# Altium schematic sheet MCU1807301205.SchDoc
size A3
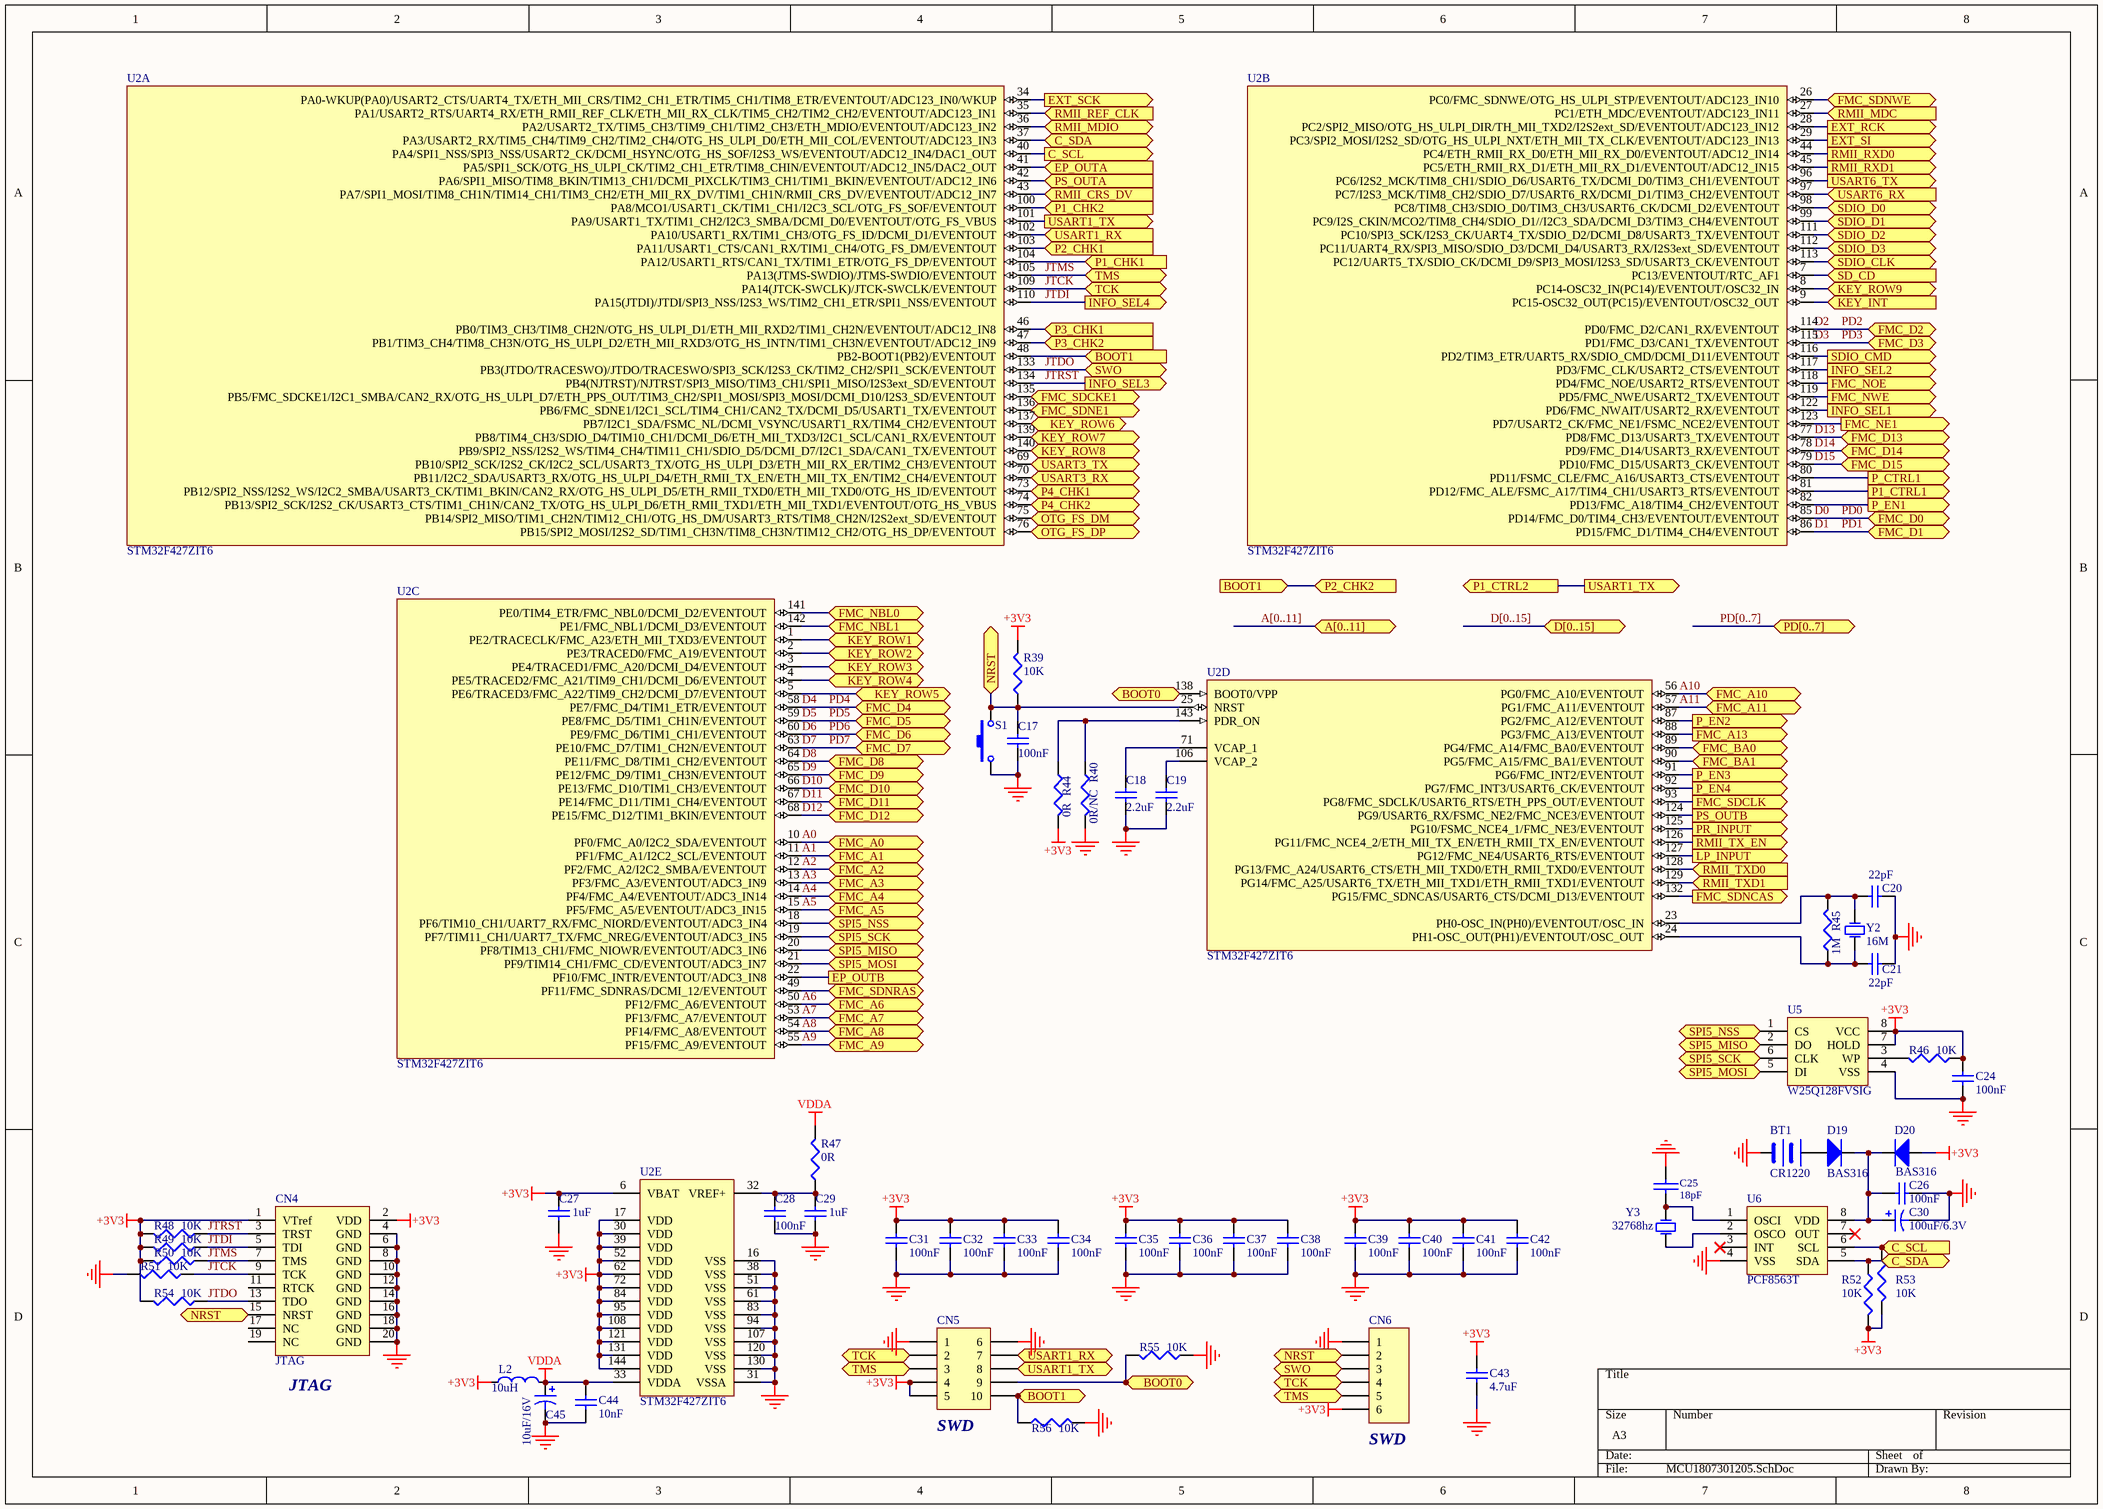
[diagram p0: MCU1807301205.SchDoc]

## Parts
BT1  CR1220  [CR1220]
C17  100nF  [C0603]
C18  2.2uF  [C0603]
C19  2.2uF  [C0603]
C20  22pF  [C0603]
C21  22pF  [C0603]
C24  100nF  [C0603]
C25  18pF  [C0603]
C26  100nF  [C0603]
C27  1uF  [C0603]
C28  100nF  [C0603]
C29  1uF  [C0603]
C30  100uF/6.3V  [CE1210]
C31  100nF  [C0603]
C32  100nF  [C0603]
C33  100nF  [C0603]
C34  100nF  [C0603]
C35  100nF  [C0603]
C36  100nF  [C0603]
C37  100nF  [C0603]
C38  100nF  [C0603]
C39  100nF  [C0603]
C40  100nF  [C0603]
C41  100nF  [C0603]
C42  100nF  [C0603]
C43  4.7uF  [C0805]
C44  10nF  [C0603]
C45  10uF/16V  [CE1210]
CN4  JTAG  [DC3-2x10P]
CN5  (no value)  [HDR2X5_CEN]
CN6  (no value)  [HDR1X6]
D19  BAS316  [D0805]
D20  BAS316  [D0805]
L2  10uH  [b0805]
R39  10K  [R0603]
R40  0R/NC  [R0603]
R44  0R  [R0603]
R45  1M  [R0603]
R46  10K  [R0603]
R47  0R  [R0603]
R48  10K  [R0603]
R49  10K  [R0603]
R50  10K  [R0603]
R51  10K  [R0603]
R52  10K  [R0603]
R53  10K  [R0603]
R54  10K  [R0603]
R55  10K  [R0603]
R56  10K  [R0603]
S1  (no value)  [SW_1102S]
U2  STM32F427ZIT6  [LQFP144_M]  (parts A,B,C,D,E of 5)
U5  W25Q128FVSIG  [SOIC8W]
U6  PCF8563T  [SOIC8]
Y2  16M  [OSC3225]
Y3  32768hz  [FC-135]

## Ports
A[0..11] (bidir), BOOT0, BOOT1, BOOT1 (in), C_SCL (in), C_SCL (out), C_SDA, C_SDA (bidir), D[0..15] (bidir), EP_OUTA (in), EP_OUTB (out), EXT_RCK (out), EXT_SCK (out), EXT_SI (out), FMC_A0, FMC_A1, FMC_A2, FMC_A3, FMC_A4, FMC_A5, FMC_A6, FMC_A7, FMC_A8, FMC_A9, FMC_A10, FMC_A11, FMC_A13 (out), FMC_BA0, FMC_BA1, FMC_D0, FMC_D1, FMC_D2, FMC_D3, FMC_D4, FMC_D5, FMC_D6, FMC_D7, FMC_D8, FMC_D9, FMC_D10, FMC_D11, FMC_D12, FMC_D13, FMC_D14, FMC_D15, FMC_NBL0, FMC_NBL1, FMC_NE1 (out), FMC_NOE (out), FMC_NWE (out), FMC_SDCKE1, FMC_SDCLK (out), FMC_SDNCAS (out), FMC_SDNE1, FMC_SDNRAS, FMC_SDNWE, INFO_SEL1 (out), INFO_SEL2 (out), INFO_SEL3 (out), INFO_SEL4 (out), KEY_INT (in), KEY_ROW1 (bidir), KEY_ROW2 (bidir), KEY_ROW3 (bidir), KEY_ROW4 (bidir), KEY_ROW5 (bidir), KEY_ROW6 (bidir), KEY_ROW7 (bidir), KEY_ROW8 (bidir), KEY_ROW9 (bidir), LP_INPUT (out), NRST, OTG_FS_DM, OTG_FS_DP, P1_CHK1 (in), P1_CHK2 (in), P1_CTRL1 (out), P1_CTRL2 (out), P2_CHK1 (in), P2_CHK2 (in), P3_CHK1 (in), P3_CHK2 (in), P4_CHK1 (in), P4_CHK2 (in), P_CTRL1 (out), P_EN1 (out), P_EN2 (out), P_EN3 (out), P_EN4 (out), PD[0..7] (bidir), PR_INPUT (out), PS_OUTA (in), PS_OUTB (out), RMII_CRS_DV (in), RMII_MDC (in), RMII_MDIO (bidir), RMII_REF_CLK (in), RMII_RXD0 (out), RMII_RXD1 (out), RMII_TX_EN (out), RMII_TXD0 (in), RMII_TXD1 (in), SD_CD (in), SDIO_CLK (bidir), SDIO_CMD (out), SDIO_D0 (bidir), SDIO_D1 (bidir), SDIO_D2 (bidir), SDIO_D3 (bidir), SPI5_MISO, SPI5_MOSI, SPI5_NSS, SPI5_SCK, SWO, TCK, TMS, USART1_RX, USART1_RX (in), USART1_TX, USART1_TX (out), USART3_RX (in), USART3_TX (out), USART6_RX (in), USART6_TX (out)

## Nets
+3V3: C24.1 C27.2 C31.1 C32.1 C33.1 C34.1 C35.1 C36.1 C37.1 C38.1 C39.1 C40.1 C41.1 C42.1 C43.1 CN4.1(VTref) CN4.2(VDD) CN5.4 CN5.5 CN6.6 D20.1(A) L2.1 R39.2 R44.2 R46.1 R48.2 R49.2 R50.2 R52.2 R53.2 R54.2 U2.6(VBAT) U2.17(VDD) U2.30(VDD) U2.39(VDD) U2.52(VDD) U2.62(VDD) U2.72(VDD) U2.84(VDD) U2.95(VDD) U2.108(VDD) U2.121(VDD) U2.131(VDD) U2.144(VDD) U5.7(HOLD) U5.8(VCC)
GND: BT1.2(-) C17.2 C18.2 C19.2 C20.2 C21.2 C24.2 C25.2 C26.2 C27.1 C28.2 C29.2 C30.2 C31.2 C32.2 C33.2 C34.2 C35.2 C36.2 C37.2 C38.2 C39.2 C40.2 C41.2 C42.2 C43.2 C44.2 C45.2 CN4.4(GND) CN4.6(GND) CN4.8(GND) CN4.10(GND) CN4.12(GND) CN4.14(GND) CN4.16(GND) CN4.18(GND) CN4.20(GND) CN5.1 CN5.6 CN6.1 R40.2 R51.2 R55.1 R56.2 S1.2 U2.16(VSS) U2.31(VSSA) U2.38(VSS) U2.51(VSS) U2.61(VSS) U2.83(VSS) U2.94(VSS) U2.107(VSS) U2.120(VSS) U2.130(VSS) U5.4(VSS) U6.4(VSS)
VDDA: C44.1 C45.1 L2.2 R47.2 U2.33(VDDA)
A0: U2.10(PF0/FMC_A0/I2C2_SDA/EVENTOUT) ; port FMC_A0
A1: U2.11(PF1/FMC_A1/I2C2_SCL/EVENTOUT) ; port FMC_A1
A2: U2.12(PF2/FMC_A2/I2C2_SMBA/EVENTOUT) ; port FMC_A2
A3: U2.13(PF3/FMC_A3/EVENTOUT/ADC3_IN9) ; port FMC_A3
A4: U2.14(PF4/FMC_A4/EVENTOUT/ADC3_IN14) ; port FMC_A4
A5: U2.15(PF5/FMC_A5/EVENTOUT/ADC3_IN15) ; port FMC_A5
A6: U2.50(PF12/FMC_A6/EVENTOUT) ; port FMC_A6
A7: U2.53(PF13/FMC_A7/EVENTOUT) ; port FMC_A7
A8: U2.54(PF14/FMC_A8/EVENTOUT) ; port FMC_A8
A9: U2.55(PF15/FMC_A9/EVENTOUT) ; port FMC_A9
A10: U2.56(PG0/FMC_A10/EVENTOUT) ; port FMC_A10
A11: U2.57(PG1/FMC_A11/EVENTOUT) ; port FMC_A11
BOOT0: CN5.9 R55.2 U2.138(BOOT0/VPP) ; port BOOT0
BOOT1: CN5.10 R56.1 U2.48(PB2-BOOT1(PB2)/EVENTOUT) ; port BOOT1, port P2_CHK2
C_SCL: R53.1 U2.40(PA4/SPI1_NSS/SPI3_NSS/USART2_CK/DCMI_HSYNC/OTG_HS_SOF/I2S3_WS/EVENTOUT/ADC12_IN4/DAC1_OUT) U6.6(SCL) ; port C_SCL
C_SDA: R52.1 U2.37(PA3/USART2_RX/TIM5_CH4/TIM9_CH2/TIM2_CH4/OTG_HS_ULPI_D0/ETH_MII_COL/EVENTOUT/ADC123_IN3) U6.5(SDA) ; port C_SDA
D0: U2.85(PD14/FMC_D0/TIM4_CH3/EVENTOUT/EVENTOUT) ; port FMC_D0  [also labelled PD0]
D1: U2.86(PD15/FMC_D1/TIM4_CH4/EVENTOUT) ; port FMC_D1  [also labelled PD1]
D2: U2.114(PD0/FMC_D2/CAN1_RX/EVENTOUT) ; port FMC_D2  [also labelled PD2]
D3: U2.115(PD1/FMC_D3/CAN1_TX/EVENTOUT) ; port FMC_D3  [also labelled PD3]
D4: U2.58(PE7/FMC_D4/TIM1_ETR/EVENTOUT) ; port FMC_D4  [also labelled PD4]
D5: U2.59(PE8/FMC_D5/TIM1_CH1N/EVENTOUT) ; port FMC_D5  [also labelled PD5]
D6: U2.60(PE9/FMC_D6/TIM1_CH1/EVENTOUT) ; port FMC_D6  [also labelled PD6]
D7: U2.63(PE10/FMC_D7/TIM1_CH2N/EVENTOUT) ; port FMC_D7  [also labelled PD7]
D8: U2.64(PE11/FMC_D8/TIM1_CH2/EVENTOUT) ; port FMC_D8
D9: U2.65(PE12/FMC_D9/TIM1_CH3N/EVENTOUT) ; port FMC_D9
D10: U2.66(PE13/FMC_D10/TIM1_CH3/EVENTOUT) ; port FMC_D10
D11: U2.67(PE14/FMC_D11/TIM1_CH4/EVENTOUT) ; port FMC_D11
D12: U2.68(PE15/FMC_D12/TIM1_BKIN/EVENTOUT) ; port FMC_D12
D13: U2.77(PD8/FMC_D13/USART3_TX/EVENTOUT) ; port FMC_D13
D14: U2.78(PD9/FMC_D14/USART3_RX/EVENTOUT) ; port FMC_D14
D15: U2.79(PD10/FMC_D15/USART3_CK/EVENTOUT) ; port FMC_D15
EP_OUTA: U2.41(PA5/SPI1_SCK/OTG_HS_ULPI_CK/TIM2_CH1_ETR/TIM8_CHIN/EVENTOUT/ADC12_IN5/DAC2_OUT) ; port EP_OUTA
EP_OUTB: U2.22(PF10/FMC_INTR/EVENTOUT/ADC3_IN8) ; port EP_OUTB
EXT_RCK: U2.28(PC2/SPI2_MISO/OTG_HS_ULPI_DIR/TH_MII_TXD2/I2S2ext_SD/EVENTOUT/ADC123_IN12) ; port EXT_RCK
EXT_SCK: U2.34(PA0-WKUP(PA0)/USART2_CTS/UART4_TX/ETH_MII_CRS/TIM2_CH1_ETR/TIM5_CH1/TIM8_ETR/EVENTOUT/ADC123_IN0/WKUP) ; port EXT_SCK
EXT_SI: U2.29(PC3/SPI2_MOSI/I2S2_SD/OTG_HS_ULPI_NXT/ETH_MII_TX_CLK/EVENTOUT/ADC123_IN13) ; port EXT_SI
FMC_A13: U2.88(PG3/FMC_A13/EVENTOUT) ; port FMC_A13
FMC_BA0: U2.89(PG4/FMC_A14/FMC_BA0/EVENTOUT) ; port FMC_BA0
FMC_BA1: U2.90(PG5/FMC_A15/FMC_BA1/EVENTOUT) ; port FMC_BA1
FMC_NBL0: U2.141(PE0/TIM4_ETR/FMC_NBL0/DCMI_D2/EVENTOUT) ; port FMC_NBL0
FMC_NBL1: U2.142(PE1/FMC_NBL1/DCMI_D3/EVENTOUT) ; port FMC_NBL1
FMC_NE1: U2.123(PD7/USART2_CK/FMC_NE1/FSMC_NCE2/EVENTOUT) ; port FMC_NE1
FMC_NOE: U2.118(PD4/FMC_NOE/USART2_RTS/EVENTOUT) ; port FMC_NOE
FMC_NWE: U2.119(PD5/FMC_NWE/USART2_TX/EVENTOUT) ; port FMC_NWE
FMC_SDCKE1: U2.135(PB5/FMC_SDCKE1/I2C1_SMBA/CAN2_RX/OTG_HS_ULPI_D7/ETH_PPS_OUT/TIM3_CH2/SPI1_MOSI/SPI3_MOSI/DCMI_D10/I2S3_SD/EVENTOUT) ; port FMC_SDCKE1
FMC_SDCLK: U2.93(PG8/FMC_SDCLK/USART6_RTS/ETH_PPS_OUT/EVENTOUT) ; port FMC_SDCLK
FMC_SDNCAS: U2.132(PG15/FMC_SDNCAS/USART6_CTS/DCMI_D13/EVENTOUT) ; port FMC_SDNCAS
FMC_SDNE1: U2.136(PB6/FMC_SDNE1/I2C1_SCL/TIM4_CH1/CAN2_TX/DCMI_D5/USART1_TX/EVENTOUT) ; port FMC_SDNE1
FMC_SDNRAS: U2.49(PF11/FMC_SDNRAS/DCMI_12/EVENTOUT) ; port FMC_SDNRAS
FMC_SDNWE: U2.26(PC0/FMC_SDNWE/OTG_HS_ULPI_STP/EVENTOUT/ADC123_IN10) ; port FMC_SDNWE
INFO_SEL1: U2.122(PD6/FMC_NWAIT/USART2_RX/EVENTOUT) ; port INFO_SEL1
INFO_SEL2: U2.117(PD3/FMC_CLK/USART2_CTS/EVENTOUT) ; port INFO_SEL2
JTCK: CN4.9(TCK) CN5.2 CN6.4 R51.1 U2.109(PA14(JTCK-SWCLK)/JTCK-SWCLK/EVENTOUT) ; port TCK
JTDI: CN4.5(TDI) R49.1 U2.110(PA15(JTDI)/JTDI/SPI3_NSS/I2S3_WS/TIM2_CH1_ETR/SPI1_NSS/EVENTOUT) ; port INFO_SEL4
JTDO: CN4.13(TDO) CN6.3 R54.1 U2.133(PB3(JTDO/TRACESWO)/JTDO/TRACESWO/SPI3_SCK/I2S3_CK/TIM2_CH2/SPI1_SCK/EVENTOUT) ; port SWO
JTMS: CN4.7(TMS) CN5.3 CN6.5 R50.1 U2.105(PA13(JTMS-SWDIO)/JTMS-SWDIO/EVENTOUT) ; port TMS
JTRST: CN4.3(TRST) R48.1 U2.134(PB4(NJTRST)/NJTRST/SPI3_MISO/TIM3_CH1/SPI1_MISO/I2S3ext_SD/EVENTOUT) ; port INFO_SEL3
KEY_INT: U2.9(PC15-OSC32_OUT(PC15)/EVENTOUT/OSC32_OUT) ; port KEY_INT
KEY_ROW1: U2.1(PE2/TRACECLK/FMC_A23/ETH_MII_TXD3/EVENTOUT) ; port KEY_ROW1
KEY_ROW2: U2.2(PE3/TRACED0/FMC_A19/EVENTOUT) ; port KEY_ROW2
KEY_ROW3: U2.3(PE4/TRACED1/FMC_A20/DCMI_D4/EVENTOUT) ; port KEY_ROW3
KEY_ROW4: U2.4(PE5/TRACED2/FMC_A21/TIM9_CH1/DCMI_D6/EVENTOUT) ; port KEY_ROW4
KEY_ROW5: U2.5(PE6/TRACED3/FMC_A22/TIM9_CH2/DCMI_D7/EVENTOUT) ; port KEY_ROW5
KEY_ROW6: U2.137(PB7/I2C1_SDA/FSMC_NL/DCMI_VSYNC/USART1_RX/TIM4_CH2/EVENTOUT) ; port KEY_ROW6
KEY_ROW7: U2.139(PB8/TIM4_CH3/SDIO_D4/TIM10_CH1/DCMI_D6/ETH_MII_TXD3/I2C1_SCL/CAN1_RX/EVENTOUT) ; port KEY_ROW7
KEY_ROW8: U2.140(PB9/SPI2_NSS/I2S2_WS/TIM4_CH4/TIM11_CH1/SDIO_D5/DCMI_D7/I2C1_SDA/CAN1_TX/EVENTOUT) ; port KEY_ROW8
KEY_ROW9: U2.8(PC14-OSC32_IN(PC14)/EVENTOUT/OSC32_IN) ; port KEY_ROW9
LP_INPUT: U2.127(PG12/FMC_NE4/USART6_RTS/EVENTOUT) ; port LP_INPUT
NRST: C17.1 CN4.15(NRST) CN6.2 R39.1 S1.1 U2.25(NRST) ; port NRST
OTG_FS_DM: U2.75(PB14/SPI2_MISO/TIM1_CH2N/TIM12_CH1/OTG_HS_DM/USART3_RTS/TIM8_CH2N/I2S2ext_SD/EVENTOUT) ; port OTG_FS_DM
OTG_FS_DP: U2.76(PB15/SPI2_MOSI/I2S2_SD/TIM1_CH3N/TIM8_CH3N/TIM12_CH2/OTG_HS_DP/EVENTOUT) ; port OTG_FS_DP
P1_CHK1: U2.104(PA12/USART1_RTS/CAN1_TX/TIM1_ETR/OTG_FS_DP/EVENTOUT) ; port P1_CHK1
P1_CHK2: U2.100(PA8/MCO1/USART1_CK/TIM1_CH1/I2C3_SCL/OTG_FS_SOF/EVENTOUT) ; port P1_CHK2
P1_CTRL1: U2.81(PD12/FMC_ALE/FSMC_A17/TIM4_CH1/USART3_RTS/EVENTOUT) ; port P1_CTRL1
P1_CTRL2: CN5.8 U2.101(PA9/USART1_TX/TIM1_CH2/I2C3_SMBA/DCMI_D0/EVENTOUT/OTG_FS_VBUS) ; port USART1_TX, port P1_CTRL2
P2_CHK1: U2.103(PA11/USART1_CTS/CAN1_RX/TIM1_CH4/OTG_FS_DM/EVENTOUT) ; port P2_CHK1
P3_CHK1: U2.46(PB0/TIM3_CH3/TIM8_CH2N/OTG_HS_ULPI_D1/ETH_MII_RXD2/TIM1_CH2N/EVENTOUT/ADC12_IN8) ; port P3_CHK1
P3_CHK2: U2.47(PB1/TIM3_CH4/TIM8_CH3N/OTG_HS_ULPI_D2/ETH_MII_RXD3/OTG_HS_INTN/TIM1_CH3N/EVENTOUT/ADC12_IN9) ; port P3_CHK2
P4_CHK1: U2.73(PB12/SPI2_NSS/I2S2_WS/I2C2_SMBA/USART3_CK/TIM1_BKIN/CAN2_RX/OTG_HS_ULPI_D5/ETH_RMII_TXD0/ETH_MII_TXD0/OTG_HS_ID/EVENTOUT) ; port P4_CHK1
P4_CHK2: U2.74(PB13/SPI2_SCK/I2S2_CK/USART3_CTS/TIM1_CH1N/CAN2_TX/OTG_HS_ULPI_D6/ETH_RMII_TXD1/ETH_MII_TXD1/EVENTOUT/OTG_HS_VBUS) ; port P4_CHK2
P_CTRL1: U2.80(PD11/FSMC_CLE/FMC_A16/USART3_CTS/EVENTOUT) ; port P_CTRL1
P_EN1: U2.82(PD13/FMC_A18/TIM4_CH2/EVENTOUT) ; port P_EN1
P_EN2: U2.87(PG2/FMC_A12/EVENTOUT) ; port P_EN2
P_EN3: U2.91(PG6/FMC_INT2/EVENTOUT) ; port P_EN3
P_EN4: U2.92(PG7/FMC_INT3/USART6_CK/EVENTOUT) ; port P_EN4
PR_INPUT: U2.125(PG10/FSMC_NCE4_1/FMC_NE3/EVENTOUT) ; port PR_INPUT
PS_OUTA: U2.42(PA6/SPI1_MISO/TIM8_BKIN/TIM13_CH1/DCMI_PIXCLK/TIM3_CH1/TIM1_BKIN/EVENTOUT/ADC12_IN6) ; port PS_OUTA
PS_OUTB: U2.124(PG9/USART6_RX/FSMC_NE2/FMC_NCE3/EVENTOUT) ; port PS_OUTB
RMII_CRS_DV: U2.43(PA7/SPI1_MOSI/TIM8_CH1N/TIM14_CH1/TIM3_CH2/ETH_MII_RX_DV/TIM1_CH1N/RMII_CRS_DV/EVENTOUT/ADC12_IN7) ; port RMII_CRS_DV
RMII_MDC: U2.27(PC1/ETH_MDC/EVENTOUT/ADC123_IN11) ; port RMII_MDC
RMII_MDIO: U2.36(PA2/USART2_TX/TIM5_CH3/TIM9_CH1/TIM2_CH3/ETH_MDIO/EVENTOUT/ADC123_IN2) ; port RMII_MDIO
RMII_REF_CLK: U2.35(PA1/USART2_RTS/UART4_RX/ETH_RMII_REF_CLK/ETH_MII_RX_CLK/TIM5_CH2/TIM2_CH2/EVENTOUT/ADC123_IN1) ; port RMII_REF_CLK
RMII_RXD0: U2.44(PC4/ETH_RMII_RX_D0/ETH_MII_RX_D0/EVENTOUT/ADC12_IN14) ; port RMII_RXD0
RMII_RXD1: U2.45(PC5/ETH_RMII_RX_D1/ETH_MII_RX_D1/EVENTOUT/ADC12_IN15) ; port RMII_RXD1
RMII_TX_EN: U2.126(PG11/FMC_NCE4_2/ETH_MII_TX_EN/ETH_RMII_TX_EN/EVENTOUT) ; port RMII_TX_EN
RMII_TXD0: U2.128(PG13/FMC_A24/USART6_CTS/ETH_MII_TXD0/ETH_RMII_TXD0/EVENTOUT) ; port RMII_TXD0
RMII_TXD1: U2.129(PG14/FMC_A25/USART6_TX/ETH_MII_TXD1/ETH_RMII_TXD1/EVENTOUT) ; port RMII_TXD1
SD_CD: U2.7(PC13/EVENTOUT/RTC_AF1) ; port SD_CD
SDIO_CLK: U2.113(PC12/UART5_TX/SDIO_CK/DCMI_D9/SPI3_MOSI/I2S3_SD/USART3_CK/EVENTOUT) ; port SDIO_CLK
SDIO_CMD: U2.116(PD2/TIM3_ETR/UART5_RX/SDIO_CMD/DCMI_D11/EVENTOUT) ; port SDIO_CMD
SDIO_D0: U2.98(PC8/TIM8_CH3/SDIO_D0/TIM3_CH3/USART6_CK/DCMI_D2/EVENTOUT) ; port SDIO_D0
SDIO_D1: U2.99(PC9/I2S_CKIN/MCO2/TIM8_CH4/SDIO_D1//I2C3_SDA/DCMI_D3/TIM3_CH4/EVENTOUT) ; port SDIO_D1
SDIO_D2: U2.111(PC10/SPI3_SCK/I2S3_CK/UART4_TX/SDIO_D2/DCMI_D8/USART3_TX/EVENTOUT) ; port SDIO_D2
SDIO_D3: U2.112(PC11/UART4_RX/SPI3_MISO/SDIO_D3/DCMI_D4/USART3_RX/I2S3ext_SD/EVENTOUT) ; port SDIO_D3
SPI5_MISO: U2.20(PF8/TIM13_CH1/FMC_NIOWR/EVENTOUT/ADC3_IN6) U5.2(DO) ; port SPI5_MISO
SPI5_MOSI: U2.21(PF9/TIM14_CH1/FMC_CD/EVENTOUT/ADC3_IN7) U5.5(DI) ; port SPI5_MOSI
SPI5_NSS: U2.18(PF6/TIM10_CH1/UART7_RX/FMC_NIORD/EVENTOUT/ADC3_IN4) U5.1(CS) ; port SPI5_NSS
SPI5_SCK: U2.19(PF7/TIM11_CH1/UART7_TX/FMC_NREG/EVENTOUT/ADC3_IN5) U5.6(CLK) ; port SPI5_SCK
USART1_RX: CN5.7 U2.102(PA10/USART1_RX/TIM1_CH3/OTG_FS_ID/DCMI_D1/EVENTOUT) ; port USART1_RX
USART3_RX: U2.70(PB11/I2C2_SDA/USART3_RX/OTG_HS_ULPI_D4/ETH_RMII_TX_EN/ETH_MII_TX_EN/TIM2_CH4/EVENTOUT) ; port USART3_RX
USART3_TX: U2.69(PB10/SPI2_SCK/I2S2_CK/I2C2_SCL/USART3_TX/OTG_HS_ULPI_D3/ETH_MII_RX_ER/TIM2_CH3/EVENTOUT) ; port USART3_TX
USART6_RX: U2.97(PC7/I2S3_MCK/TIM8_CH2/SDIO_D7/USART6_RX/DCMI_D1/TIM3_CH2/EVENTOUT) ; port USART6_RX
USART6_TX: U2.96(PC6/I2S2_MCK/TIM8_CH1/SDIO_D6/USART6_TX/DCMI_D0/TIM3_CH1/EVENTOUT) ; port USART6_TX
NetBT1_1: BT1.1(+) D19.1(A)
NetC18_1: C18.1 U2.71(VCAP_1)
NetC19_1: C19.1 U2.106(VCAP_2)
NetC20_1: C20.1 R45.2 U2.23(PH0-OSC_IN(PH0)/EVENTOUT/OSC_IN) Y2.1(OSC1)
NetC21_1: C21.1 R45.1 U2.24(PH1-OSC_OUT(PH1)/EVENTOUT/OSC_OUT) Y2.3(OSC2)
NetC25_1: C25.1 U6.1(OSCI) Y3.2(OSC2)
NetC26_1: C26.1 C30.1 D19.2(K) D20.2(K) U6.8(VDD)
NetC28_1: C28.1 C29.1 R47.1 U2.32(VREF+)
NetR40_1: R40.1 R44.1 U2.143(PDR_ON)
NetR46_2: R46.2 U5.3(WP)
NetU6_2: U6.2(OSCO) Y3.1(OSC1)

Not connected (* = marked no-connect by the designer): CN4 11(RTCK) 17(NC) 19(NC); U6 3(INT)* 7(OUT)*

## Buses and harness runs
bus A[0..11] = port A[0..11]
bus D[0..15] = port D[0..15]
bus PD[0..7] = port PD[0..7]

## Notes on the sheet
- (near CN4) JTAG
- (near CN5) SWD
- (near CN6) SWD

## Library data of the parts
BT1 = Battery: Multicell Battery
C17-C21 C24 C26-C29 C44 = Cap: Capacitor; Value: 100pF; Published: 8-Jun-2000; LatestRevisionDate: 17-Jul-2002; LatestRevisionNote: Re-released for DXP Platform.; PackageReference: RAD-0.3; Publisher: Altium Limited; PackageDescription: Radial Cap, Thru-Hole; 2 Leads; 0.3 in Pin Spacing
C25 = CAP: Capacitor
C30 C45 = Cap Pol1: Polarized Capacitor (Radial); Value: 100pF; Published: 8-Jun-2000; LatestRevisionDate: 17-Jul-2002; LatestRevisionNote: Re-released for DXP Platform.; PackageReference: RB7.6-15; Publisher: Altium Limited; PackageDescription: Polarized Capacitor (Radial); 2 Leads
C31-C42 = Cap: Capacitor; Value: 10nF; Published: 8-Jun-2000; Revision: July-2002: Re-released for DXP Platform.; Publisher: Altium Limited
C43 = CAP SMD 0603  X5R 1礔 25V 10%: 0603  X5R 4.7uF; Value: 1礔; Rated voltage: 25V; Tolerance: 10%; Manufacturer: *; Manufacturer P/N: *; Order code Farnell: 1288202RL; Power: *; Technology: X5R; Temperature  Factor: *; Temperature Max: +125癈; Temperature Min: -55癈; STS Code: *
CN5 = Header 5X2A: Header, 5-Pin, Dual row; LatestRevisionDate: 17-Jul-2002; LatestRevisionNote: Re-released for DXP Platform.; Publisher: Altium Limited
CN6 = Header 6: Header, 6-Pin; LatestRevisionDate: 17-Jul-2002; LatestRevisionNote: Re-released for DXP Platform.; Publisher: Altium Limited
D19 D20 = Diode
L2 = L
R39 R40 R44-R56 = Res3: Resistor; Value: 1K; Published: 8-Jun-2000; LatestRevisionDate: 29-May-2009; LatestRevisionNote: IPC-7351 Footprint Added.; PackageReference: J1-0603; Publisher: Altium Limited; PackageDescription: Chip Resistor
S1 = SW-PB: Switch
U2 = STM32F427ZIT6: ARM Cortex-M4 32b MCU+FPU, 210DMIP, 1024 kB Flash, 192+4 kB RAM, Crypto, Camera, 114 I/Os, 144-pin LQFP, -40 to +85癈, Tray; Internal RAM: 192kB; Operating Frequency (Processor Speed): 168MHz; A/D Converter: 24x12-bit; D/A Converter: 2x12-bit; 16-bit Timers (IC/OC/PWM): 12x16-bit(24/24/30); 32-bit Timer (IC/OC/PWM): 2x32-bit (8/8/8); Other Timer Functions: 2xWDG, RTC, 24-bit down counter; Serial Interface: 3xSPI/2xI2S/2xI2C/3xUSART(IrDa, ISO7816)/3xUART/2xUSB OTG FS/HS, 2xCAN/Ethernet MAC10/100, SDIO; DatasheetVersion: rev2, Jan-2012; PackageVersion: 2012; PackageReference: TQFP144; PackageDescription: 144-Pin Low Profile Quad Flat Package, 20x20 mm Body, 0.5 mm Pitch; ComponentLink1Description: Manufacturer URL; ComponentLink1URL: http://www.st.com/; ComponentLink2Description: STM32F415/7 Datasheet; ComponentLink2URL: http://www.st.com/internet/com/TECHNICAL_RESOURCES/TECHNICAL_LITERATURE/DATASHEET/DM00035129.pdf; ComponentLink3Description: STM32F4 Web Page; ComponentLink3URL: http://www.st.com/internet/mcu/subclass/1521.jsp
U5 = W25Q128FVSIG: 3V 128M-BIT serial flash memory
Y2 = XTAL2: Crystal Oscillator; Published: 8-Jun-2000; LatestRevisionDate: 17-Jul-2002; LatestRevisionNote: Re-released for DXP Platform.; PackageReference: R38; Publisher: Altium Limited; PackageDescription: Crystal, Thru-Hole; 2 Leads; Body 3.1 x 8.2 mm (Dia.xH)
Y3 = XTAL